# Altium schematic sheet test_watch.SchDoc
size A2
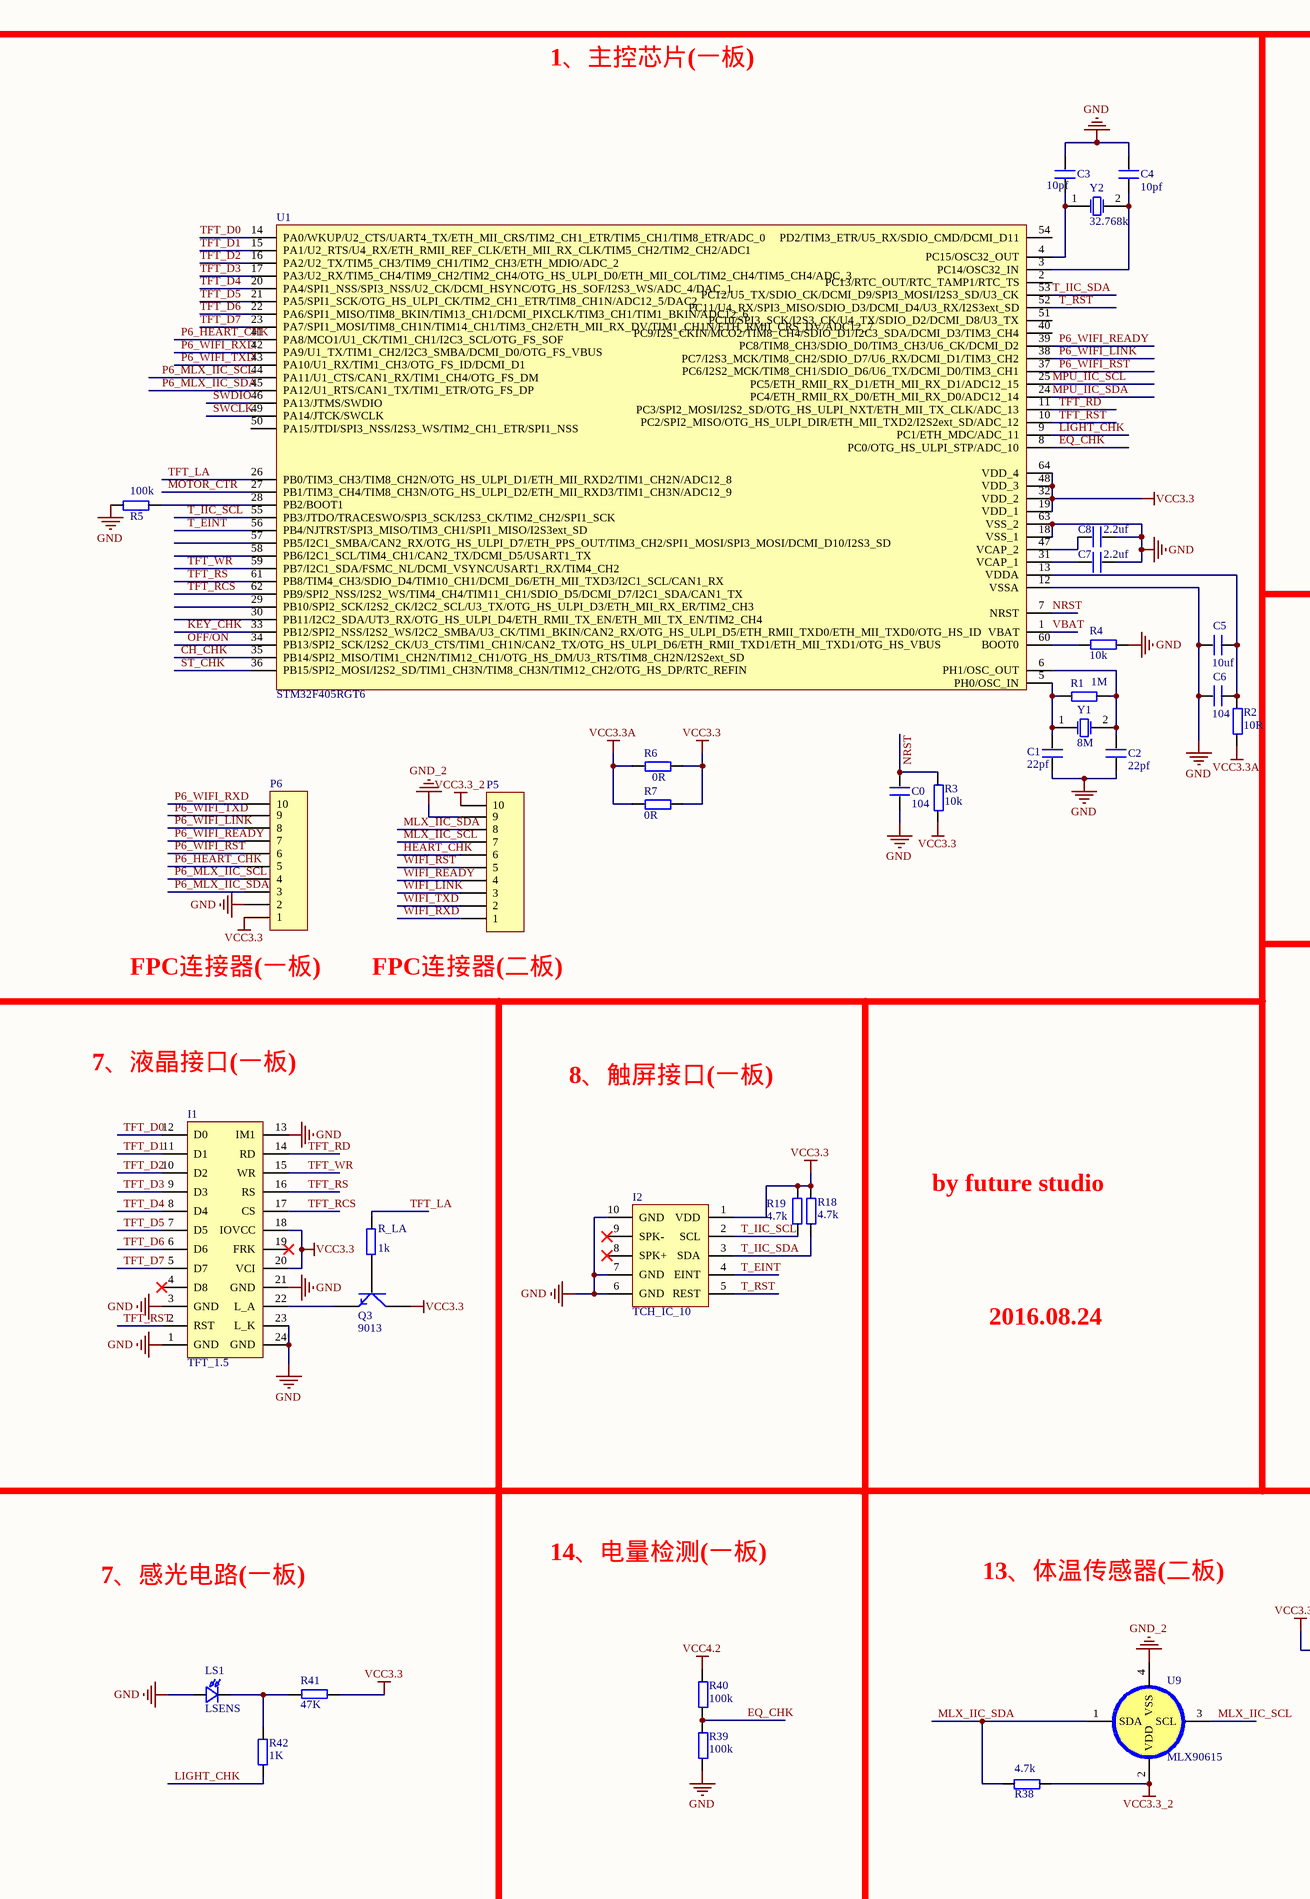
[diagram p0: test_watch.SchDoc, left]
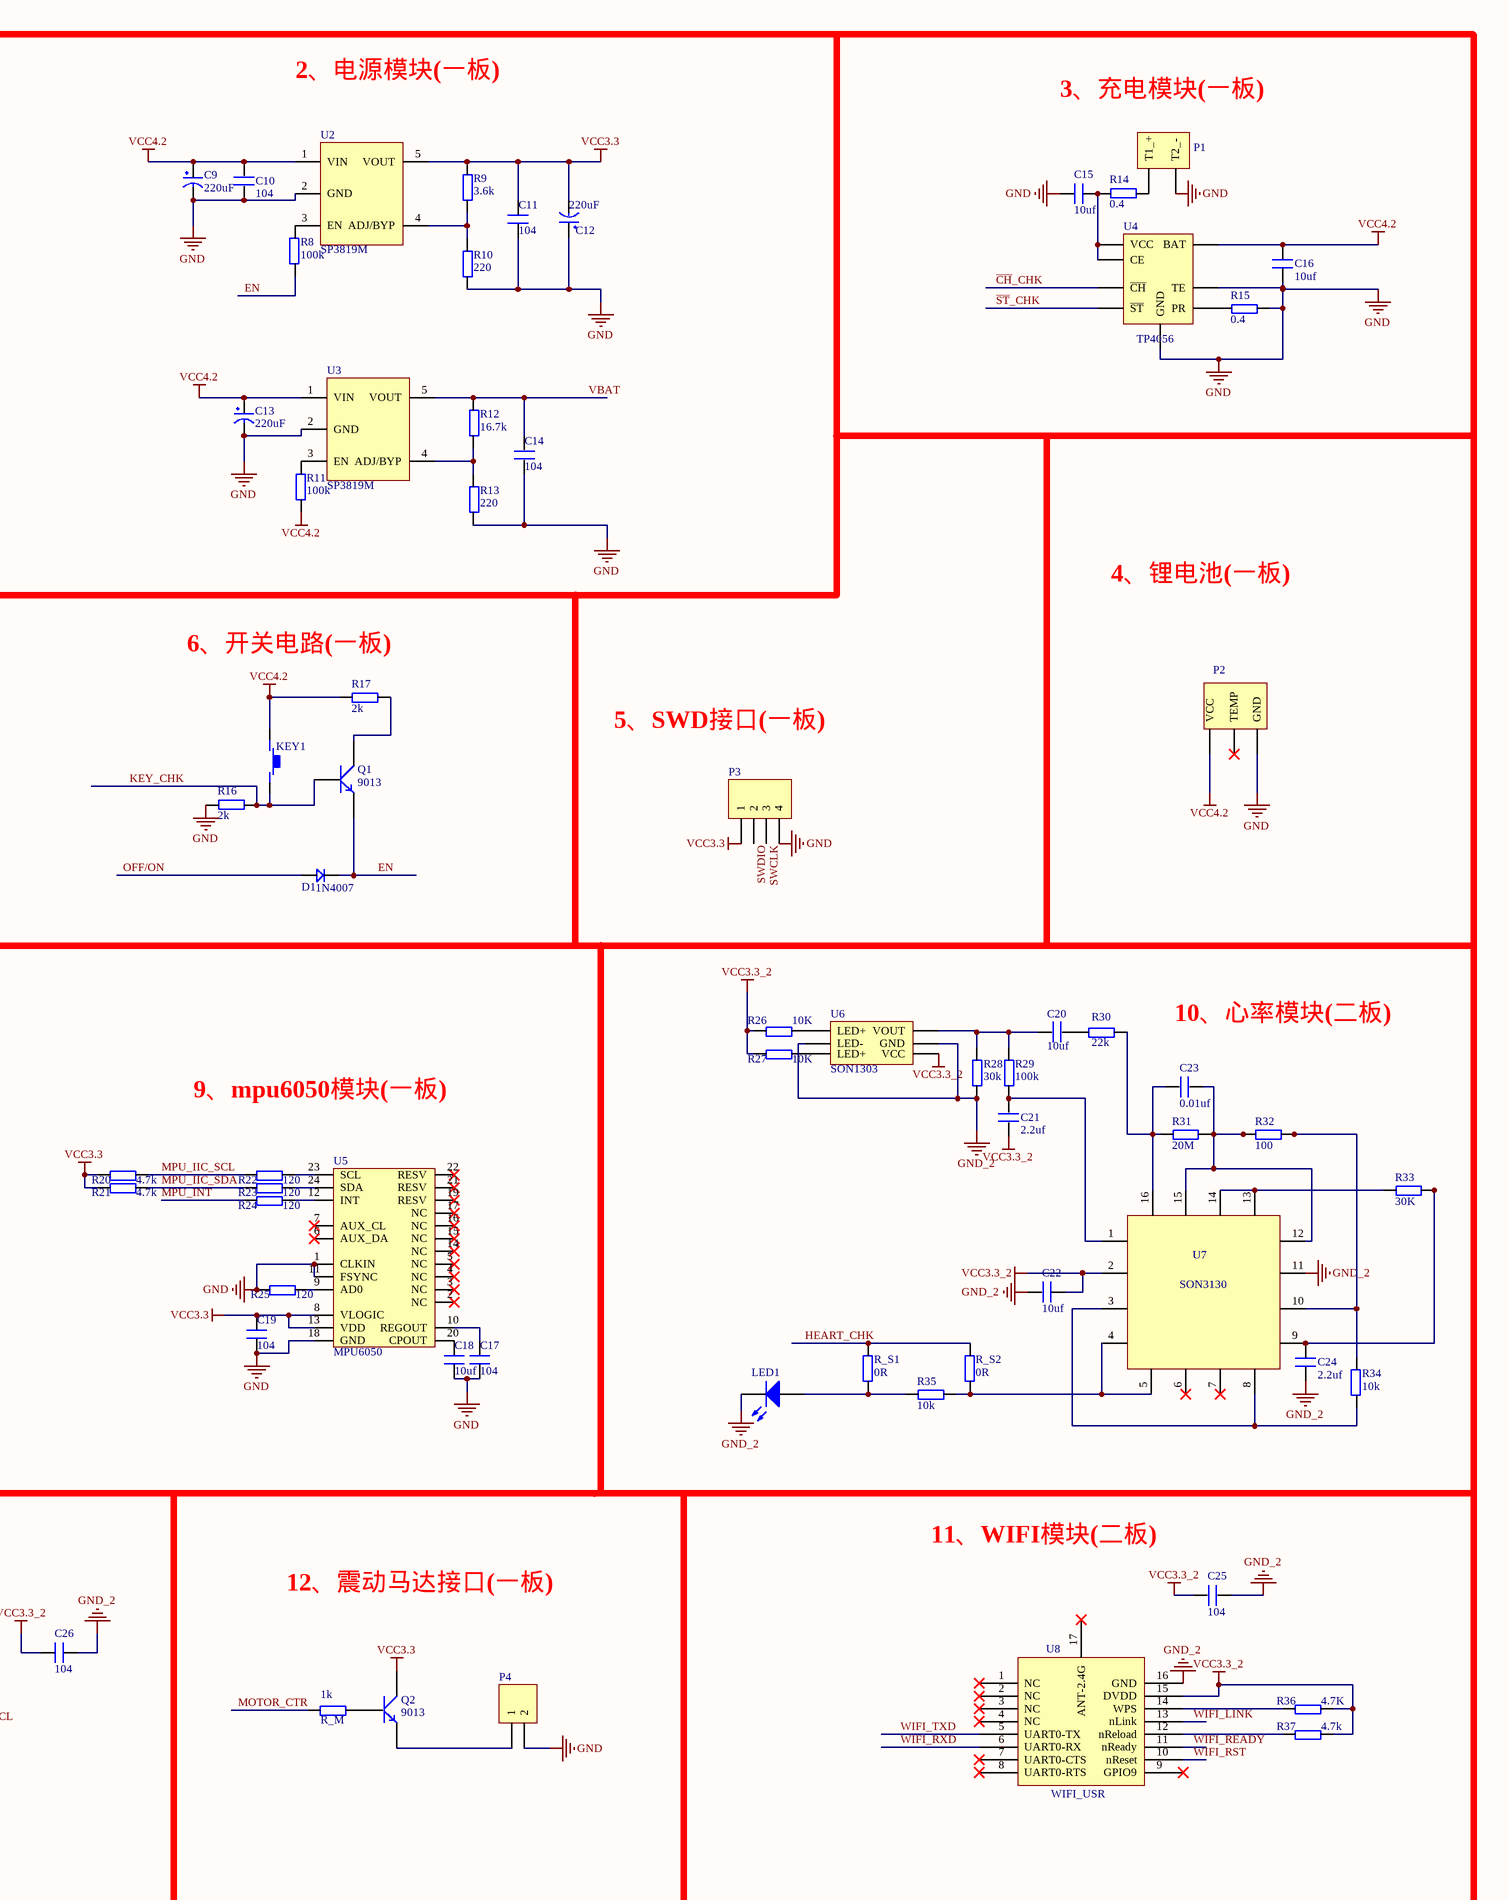
[diagram p1: test_watch.SchDoc, right]

## Parts
C0  104  [C_0603]
C1  22pf  [C_0402]
C2  22pf  [C_0402]
C3  10pf  [C_0402]
C4  10pf  [C_0402]
C5  10uf  [C_0402]
C6  104  [C_0603]
C7  2.2uf  [C_0402]
C8  2.2uf  [C_0402]
C9  220uF  [C_3528]
C10  104  [C_0603]
C11  104  [C_0603]
C12  220uF  [C_3528]
C13  220uF  [C_3528]
C14  104  [C_0603]
C15  10uf  [C_0402]
C16  10uf  [C_0402]
C17  104  [C_0603]
C18  10uf  [C_0402]
C19  104  [C_0603]
C20  10uf  [C_0402]
C21  2.2uf  [C_0402]
C22  10uf  [C_0402]
C23  0.01uf  [C_0603]
C24  2.2uf  [C_0402]
C25  104  [C_0603]
C26  104  [C_0603]
D1  1N4007  [D_0805]
I1  TFT_1.5  [DF37NB-24DS-0.4V - duplicate]
I2  TCH_IC_10  [DF37NB-10DS-0.4V]
KEY1  button_2pin  [SMD2_3.5]  (value not drawn)
LED1  LED1  [D_0603]  (value not drawn)
LS1  LSENS  [0805]
P1  contactor  [CHARGE_2]  (value not drawn)
P2  CELL  [CELL_2]  (value not drawn)
P3  Header 4  [SWD]  (value not drawn)
P4  MIC/LINE  [CHARGE_2]  (value not drawn)
P5  Header-10  [FPC_10_0.5]  (value not drawn)
P6  Header-10  [FPC_10_0.5]  (value not drawn)
Q1  9013  [SOT-23R]
Q2  9013  [SOT-23R]
Q3  9013  [SOT-23R]
R1  1M  [R_0402]
R2  10R  [R_0402]
R3  10k  [R_0402]
R4  10k  [R_0402]
R5  100k  [R_0402]
R6  0R  [R_0402]
R7  0R  [R_0402]
R8  100k  [R_0402]
R9  3.6k  [R_0603]
R10  220  [R_0402]
R11  100k  [R_0402]
R12  16.7k  [R_0603]
R13  220  [R_0402]
R14  0.4  [R_1206]
R15  0.4  [R_1206]
R16  2k  [R_0402]
R17  2k  [R_0402]
R18  4.7k  [R_0402]
R19  4.7k  [R_0402]
R20  4.7k  [R_0402]
R21  4.7k  [R_0402]
R22  120  [R_0402]
R23  120  [R_0402]
R24  120  [R_0402]
R25  120  [R_0402]
R26  10K  [R_0402]
R27  10K  [R_0402]
R28  30k  [R_0402]
R29  100k  [R_0402]
R30  22k  [R_0402]
R31  20M  [R_0603]
R32  100  [R_0402]
R33  30K  [R_0402]
R34  10k  [R_0402]
R35  10k  [R_0402]
R36  4.7K  [R_0402]
R37  4.7k  [R_0402]
R38  4.7k  [R_0402]
R39  100k  [R_0402]
R40  100k  [R_0402]
R41  47K  [R_0402]
R42  1K  [R_0402]
R_LA  1k  [R_0402]
R_M  1k  [R_0402]
R_S1  0R  [R_0402]
R_S2  0R  [R_0402]
U1  STM32F405RGT6  [LQFP64]
U2  SP3819M  [SPX3819]
U3  SP3819M  [SPX3819]
U4  TP4056  [TP4056]
U5  MPU6050  [MPU6050_QFN24]
U6  SON1303  [SON7015]
U7  SON3130  [SON3130_QFN16]
U8  WIFI_USR  [WIFI_USR]
U9  MLX90615  [MLX90615]
Y1  8M  [TXAL_5032_2]
Y2  32.768k  [TXAL_3215]

## Nets
GND: C0.2 C1.1 C2.1 C3.2 C4.2 C5.2 C6.2 C7.2 C8.2 C9.2(GND) C10.2 C11.2 C12.1(VCC) C13.2(GND) C14.2 C15.2 C16.1 C17.1 C18.1 C19.1 I1.1(GND) I1.3(GND) I1.13(IM1) I1.21(GND) I1.23(L_K) I1.24(GND) I2.6(GND) I2.7(GND) I2.10(GND) LS1.1 P1.2(T2_-) P2.2(GND) P3.4 P4.2 P6.2 R4.1 R5.1 R10.1 R13.1 R15.2 R16.2 R25.1 R39.1 U1.12(VSSA) U1.18(VSS_1) U1.63(VSS_2) U2.2(GND) U3.2(GND) U4.1(TE) U4.3(GND) U5.1(CLKIN) U5.11(FSYNC) U5.18(GND)
GND_2: C22.1 C24.1 C25.1 C26.1 LED1.2(K) P5.9 R28.1 U6.2(LED-) U6.5(GND) U7.11 U8.16(GND) U9.4(VSS)
VCC3.3: C11.1 C12.2(GND) C19.2 I1.18(IOVCC) I1.20(VCI) I2.1(VDD) P3.1 P6.1 Q2.3(C) Q3.3(C) R3.1 R6.2 R7.2 R9.2 R18.2 R19.1 R20.1 R21.1 R41.1 U1.19(VDD_1) U1.32(VDD_2) U1.48(VDD_3) U1.64(VDD_4) U2.5(VOUT) U5.8(VLOGIC) U5.13(VDD)
VCC3.3_2: C21.2 C22.2 C25.2 C26.2 P5.10 R26.1 R27.1 R36.2 R37.2 R38.2 U6.4(VCC) U7.2 U8.15(DVDD) U9.2(VDD)
VCC3.3A: R2.1 R6.1 R7.1
VCC4.2: C9.1(VCC) C10.1 C13.1(VCC) C16.2 KEY1.1(P1) P2.1(VCC) R11.2 R17.1 R40.2 U2.1(VIN) U3.1(VIN) U4.5(BAT)
~{CH}_CHK: U1.35(PB14/SPI2_MISO/TIM1_CH2N/TIM12_CH1/OTG_HS_DM/U3_RTS/TIM8_CH2N/I2S2ext_SD) U4.7(~{CH})
EN: D1.2 Q1.2(E) R8.2
EQ_CHK: R39.2 R40.1 U1.8(PC0/OTG_HS_ULPI_STP/ADC_10)
HEART_CHK: P5.6 R_S1.1 R_S2.1
KEY_CHK: KEY1.2(P2) Q1.1(B) R16.1 U1.33(PB12/SPI2_NSS/I2S2_WS/I2C2_SMBA/U3_CK/TIM1_BKIN/CAN2_RX/OTG_HS_ULPI_D5/ETH_RMII_TXD0/ETH_MII_TXD0/OTG_HS_ID)
LIGHT_CHK: R42.2 U1.9(PC1/ETH_MDC/ADC_11)
MLX_IIC_SCL: P5.7 U9.3(SCL)
MLX_IIC_SDA: P5.8 R38.1 U9.1(SDA)
MOTOR_CTR: R_M.1 U1.27(PB1/TIM3_CH4/TIM8_CH3N/OTG_HS_ULPI_D2/ETH_MII_RXD3/TIM1_CH3N/ADC12_9)
MPU_IIC_SCL: R20.2 R22.1 U1.25(PC5/ETH_RMII_RX_D1/ETH_MII_RX_D1/ADC12_15)
MPU_IIC_SDA: R21.2 R23.1 U1.24(PC4/ETH_RMII_RX_D0/ETH_MII_RX_D0/ADC12_14)
MPU_INT: R24.1
NRST: C0.1 R3.2 U1.7(NRST)
OFF/ON: D1.1 U1.34(PB13/SPI2_SCK/I2S2_CK/U3_CTS/TIM1_CH1N/CAN2_TX/OTG_HS_ULPI_D6/ETH_RMII_TXD1/ETH_MII_TXD1/OTG_HS_VBUS)
P6_HEART_CHK: P6.5 U1.41(PA8/MCO1/U1_CK/TIM1_CH1/I2C3_SCL/OTG_FS_SOF)
P6_MLX_IIC_SCL: P6.4 U1.44(PA11/U1_CTS/CAN1_RX/TIM1_CH4/OTG_FS_DM)
P6_MLX_IIC_SDA: P6.3 U1.45(PA12/U1_RTS/CAN1_TX/TIM1_ETR/OTG_FS_DP)
P6_WIFI_LINK: P6.8 U1.38(PC7/I2S3_MCK/TIM8_CH2/SDIO_D7/U6_RX/DCMI_D1/TIM3_CH2)
P6_WIFI_READY: P6.7 U1.39(PC8/TIM8_CH3/SDIO_D0/TIM3_CH3/U6_CK/DCMI_D2)
P6_WIFI_RST: P6.6 U1.37(PC6/I2S2_MCK/TIM8_CH1/SDIO_D6/U6_TX/DCMI_D0/TIM3_CH1)
P6_WIFI_RXD: P6.10 U1.42(PA9/U1_TX/TIM1_CH2/I2C3_SMBA/DCMI_D0/OTG_FS_VBUS)
P6_WIFI_TXD: P6.9 U1.43(PA10/U1_RX/TIM1_CH3/OTG_FS_ID/DCMI_D1)
~{ST}_CHK: U1.36(PB15/SPI2_MOSI/I2S2_SD/TIM1_CH3N/TIM8_CH3N/TIM12_CH2/OTG_HS_DP/RTC_REFIN) U4.6(~{ST})
SWCLK: P3.3 U1.49(PA14/JTCK/SWCLK)
SWDIO: P3.2 U1.46(PA13/JTMS/SWDIO)
T_EINT: I2.4(EINT) U1.56(PB4/NJTRST/SPI3_MISO/TIM3_CH1/SPI1_MISO/I2S3ext_SD)
T_IIC_SCL: I2.2(SCL) R19.2 U1.55(PB3/JTDO/TRACESWO/SPI3_SCK/I2S3_CK/TIM2_CH2/SPI1_SCK)
T_IIC_SDA: I2.3(SDA) R18.1 U1.53(PC12/U5_TX/SDIO_CK/DCMI_D9/SPI3_MOSI/I2S3_SD/U3_CK)
T_RST: I2.5(REST) U1.52(PC11/U4_RX/SPI3_MISO/SDIO_D3/DCMI_D4/U3_RX/I2S3ext_SD)
TFT_D0: I1.12(D0) U1.14(PA0/WKUP/U2_CTS/UART4_TX/ETH_MII_CRS/TIM2_CH1_ETR/TIM5_CH1/TIM8_ETR/ADC_0)
TFT_D1: I1.11(D1) U1.15(PA1/U2_RTS/U4_RX/ETH_RMII_REF_CLK/ETH_MII_RX_CLK/TIM5_CH2/TIM2_CH2/ADC1)
TFT_D2: I1.10(D2) U1.16(PA2/U2_TX/TIM5_CH3/TIM9_CH1/TIM2_CH3/ETH_MDIO/ADC_2)
TFT_D3: I1.9(D3) U1.17(PA3/U2_RX/TIM5_CH4/TIM9_CH2/TIM2_CH4/OTG_HS_ULPI_D0/ETH_MII_COL/TIM2_CH4/TIM5_CH4/ADC_3)
TFT_D4: I1.8(D4) U1.20(PA4/SPI1_NSS/SPI3_NSS/U2_CK/DCMI_HSYNC/OTG_HS_SOF/I2S3_WS/ADC_4/DAC_1)
TFT_D5: I1.7(D5) U1.21(PA5/SPI1_SCK/OTG_HS_ULPI_CK/TIM2_CH1_ETR/TIM8_CH1N/ADC12_5/DAC2)
TFT_D6: I1.6(D6) U1.22(PA6/SPI1_MISO/TIM8_BKIN/TIM13_CH1/DCMI_PIXCLK/TIM3_CH1/TIM1_BKIN/ADC12_6)
TFT_D7: I1.5(D7) U1.23(PA7/SPI1_MOSI/TIM8_CH1N/TIM14_CH1/TIM3_CH2/ETH_MII_RX_DV/TIM1_CH1N/ETH_RMII_CRS_DV/ADC12_7)
TFT_LA: R_LA.1 U1.26(PB0/TIM3_CH3/TIM8_CH2N/OTG_HS_ULPI_D1/ETH_MII_RXD2/TIM1_CH2N/ADC12_8)
TFT_RCS: I1.17(CS) U1.62(PB9/SPI2_NSS/I2S2_WS/TIM4_CH4/TIM11_CH1/SDIO_D5/DCMI_D7/I2C1_SDA/CAN1_TX)
TFT_RD: I1.14(RD) U1.11(PC3/SPI2_MOSI/I2S2_SD/OTG_HS_ULPI_NXT/ETH_MII_TX_CLK/ADC_13)
TFT_RS: I1.16(RS) U1.61(PB8/TIM4_CH3/SDIO_D4/TIM10_CH1/DCMI_D6/ETH_MII_TXD3/I2C1_SCL/CAN1_RX)
TFT_RST: I1.2(RST) U1.10(PC2/SPI2_MISO/OTG_HS_ULPI_DIR/ETH_MII_TXD2/I2S2ext_SD/ADC_12)
TFT_WR: I1.15(WR) U1.59(PB7/I2C1_SDA/FSMC_NL/DCMI_VSYNC/USART1_RX/TIM4_CH2)
VBAT: C14.1 R12.2 U1.1(VBAT) U3.5(VOUT)
WIFI_LINK: P5.3 U8.13(nLink)
WIFI_READY: P5.4 U8.11(nReady)
WIFI_RST: P5.5 U8.10(nReset)
WIFI_RXD: P5.1 U8.6(UART0-RX)
WIFI_TXD: P5.2 U8.5(UART0-TX)
NetC1_2: C1.2 R1.1 U1.5(PH0/OSC_IN) Y1.1(OSC1)
NetC2_2: C2.2 R1.2 U1.6(PH1/OSC_OUT) Y1.2(OSC2)
NetC3_1: C3.1 U1.4(PC15/OSC32_OUT) Y2.1(OSC1)
NetC4_1: C4.1 U1.3(PC14/OSC32_IN) Y2.2(OSC2)
NetC5_1: C5.1 C6.1 R2.2 U1.13(VDDA)
NetC7_1: C7.1 U1.31(VCAP_1)
NetC8_1: C8.1 U1.47(VCAP_2)
NetC15_1: C15.1 R14.2 U4.4(VCC) U4.8(CE)
NetC17_2: C17.2 U5.10(REGOUT)
NetC18_2: C18.2 U5.20(CPOUT)
NetC20_1: C20.1 R30.1
NetC20_2: C20.2 R28.2 R29.2 U6.6(VOUT)
NetC21_1: C21.1 R29.1 U7.1
NetC23_1: C23.1 R31.2 R32.1 U7.12 U7.15
NetC23_2: C23.2 R30.2 R31.1 U7.16
NetC24_2: C24.2 R33.2 U7.9
NetI1_22: I1.22(L_A) Q3.2(E)
NetLED1_1: LED1.1(A) R35.1 R_S1.2
NetLS1_2: LS1.2 R41.2 R42.1
NetP1_1: P1.1(T1_+) R14.1
NetP4_1: P4.1 Q2.2(E)
NetQ1_3: Q1.3(C) R17.2
NetQ3_1: Q3.1(B) R_LA.2
NetR4_2: R4.2 U1.60(BOOT0)
NetR5_2: R5.2 U1.28(PB2/BOOT1)
NetR8_1: R8.1 U2.3(EN)
NetR9_1: R9.1 R10.2 U2.4(ADJ/BYP)
NetR11_1: R11.1 U3.3(EN)
NetR12_1: R12.1 R13.2 U3.4(ADJ/BYP)
NetR15_1: R15.1 U4.2(PR)
NetR22_2: R22.2 U5.23(SCL)
NetR23_2: R23.2 U5.24(SDA)
NetR24_2: R24.2 U5.12(INT)
NetR25_2: R25.2 U5.9(AD0)
NetR26_2: R26.2 U6.1(LED+)
NetR27_2: R27.2 U6.3(LED+)
NetR32_2: R32.2 R34.1 U7.10
NetR33_1: R33.1 U7.13 U7.14
NetR34_2: R34.2 U7.3 U7.8
NetR35_2: R35.2 R_S2.2 U7.4 U7.5
NetR36_1: R36.1 U8.14(WPS)
NetR37_1: R37.1 U8.12(nReload)

Not connected (* = marked no-connect by the designer): I1 4(D8)* 19(FRK)*; I2 8(SPK+)* 9(SPK-)*; P2 3(TEMP)*; Q2 1(B); R_M 2; U1 2(PC13/RTC_OUT/RTC_TAMP1/RTC_TS) 29(PB10/SPI2_SCK/I2S2_CK/I2C2_SCL/U3_TX/OTG_HS_ULPI_D3/ETH_MII_RX_ER/TIM2_CH3) 30(PB11/I2C2_SDA/UT3_RX/OTG_HS_ULPI_D4/ETH_RMII_TX_EN/ETH_MII_TX_EN/TIM2_CH4) 40(PC9/I2S_CKIN/MCO2/TIM8_CH4/SDIO_D1/I2C3_SDA/DCMI_D3/TIM3_CH4) 50(PA15/JTDI/SPI3_NSS/I2S3_WS/TIM2_CH1_ETR/SPI1_NSS) 51(PC10/SPI3_SCK/I2S3_CK/U4_TX/SDIO_D2/DCMI_D8/U3_TX) 54(PD2/TIM3_ETR/U5_RX/SDIO_CMD/DCMI_D11) 57(PB5/I2C1_SMBA/CAN2_RX/OTG_HS_ULPI_D7/ETH_PPS_OUT/TIM3_CH2/SPI1_MOSI/SPI3_MOSI/DCMI_D10/I2S3_SD) 58(PB6/I2C1_SCL/TIM4_CH1/CAN2_TX/DCMI_D5/USART1_TX); U5 2(NC)* 3(NC)* 4(NC)* 5(NC)* 6(AUX_DA)* 7(AUX_CL)* 14(NC)* 15(NC)* 16(NC)* 17(NC)* 19(RESV)* 21(RESV)* 22(RESV)*; U7 6* 7*; U8 1(NC)* 2(NC)* 3(NC)* 4(NC)* 7(UART0-CTS)* 8(UART0-RTS)* 9(GPIO9)* 17(ANT-2.4G)*

## Notes on the sheet
- 1、主控芯片(一板)
- 2、电源模块(一板)
- 3、充电模块(一板)
- 4、锂电池(一板)
- 6、开关电路(一板)
- 5、SWD接口(一板)
- (near P6) FPC连接器(一板)
- (near P5) FPC连接器(二板)
- 10、心率模块(二板)
- 7、液晶接口(一板)
- 8、触屏接口(一板)
- 9、mpu6050模块(一板)
- by future studio
- 2016.08.24
- 14、电量检测(一板)
- 11、WIFI模块(二板)
- 7、感光电路(一板)
- 13、体温传感器(二板)
- 12、震动马达接口(一板)

## Library data of the parts
C0-C8 C10 C11 C14-C26 = C
C9 C12 C13 = CAP
D1 = D
KEY1 = KEY_2
LED1 = LED2: Typical RED, GREEN, YELLOW, AMBER GaAs LED; Published: 8-Jun-2000; LatestRevisionDate: 17-Jul-2002; LatestRevisionNote: Re-released for DXP Platform.; PackageDocument: Feb-2002; PackageReference: 3.2X1.6X1.1; Publisher: Altium Limited
LS1 = 光敏电阻
P1 = contactor: 充电触点
P2 = CELL: 锂电池
P3 = Header 4: Header, 4-Pin; LatestRevisionDate: 17-Jul-2002; LatestRevisionNote: Re-released for DXP Platform.; Publisher: Altium Limited
P4 = Header 2_1: Header, 2-Pin; LatestRevisionDate: 17-Jul-2002; LatestRevisionNote: Re-released for DXP Platform.; Publisher: Altium Limited
Q1-Q3 = NPN: pin to pad: 1>2 2>1
R1-R42 R_LA R_M R_S1 R_S2 = R
U1 = STM32F405RGT6: F405_64脚
U2 U3 = SP3819M: 稳压器
U4 = TP4056: 充电芯片
U5 = MPU6050: 9轴运动处理传感器
U6 = SON1303: 心率传感器
U7 = SON3130: 心率传感器
U8 = WIFI_USR: wifi模块
U9 = MLX90615: 体温传感器
Y1 = XTAL_1: 32.768k; 郑子烁: 肇庆学院
Y2 = XTAL_1: 郑子烁: 肇庆学院